# Vivado block design design_1, xczu28dr-ffvg1517-2-e, Vivado 2019.1
# (continued, part 2 of 5)
current_bd_instance /rx_datapath/macro_channel_3

create_bd_cell -type ip -vlnv user.org:user:tlast_gen_v1_0:1.0 tlast_gen_v1_0_0
create_bd_cell -type ip -vlnv xilinx.com:ip:axis_data_fifo:2.0 axis_data_fifo_3
set_property -dict [list \
  CONFIG.FIFO_DEPTH 4096 \
  CONFIG.FIFO_MEMORY_TYPE block \
  CONFIG.HAS_RD_DATA_COUNT 0 \
  CONFIG.HAS_TKEEP 1 \
  CONFIG.HAS_TLAST 1 \
  CONFIG.HAS_WR_DATA_COUNT 0 \
  CONFIG.IS_ACLK_ASYNC 1 \
  CONFIG.SYNCHRONIZATION_STAGES 2 \
  CONFIG.TDATA_NUM_BYTES 64 \
] [get_bd_cells axis_data_fifo_3]

# ---- hierarchy /tx_datapath ----
current_bd_instance /tx_datapath
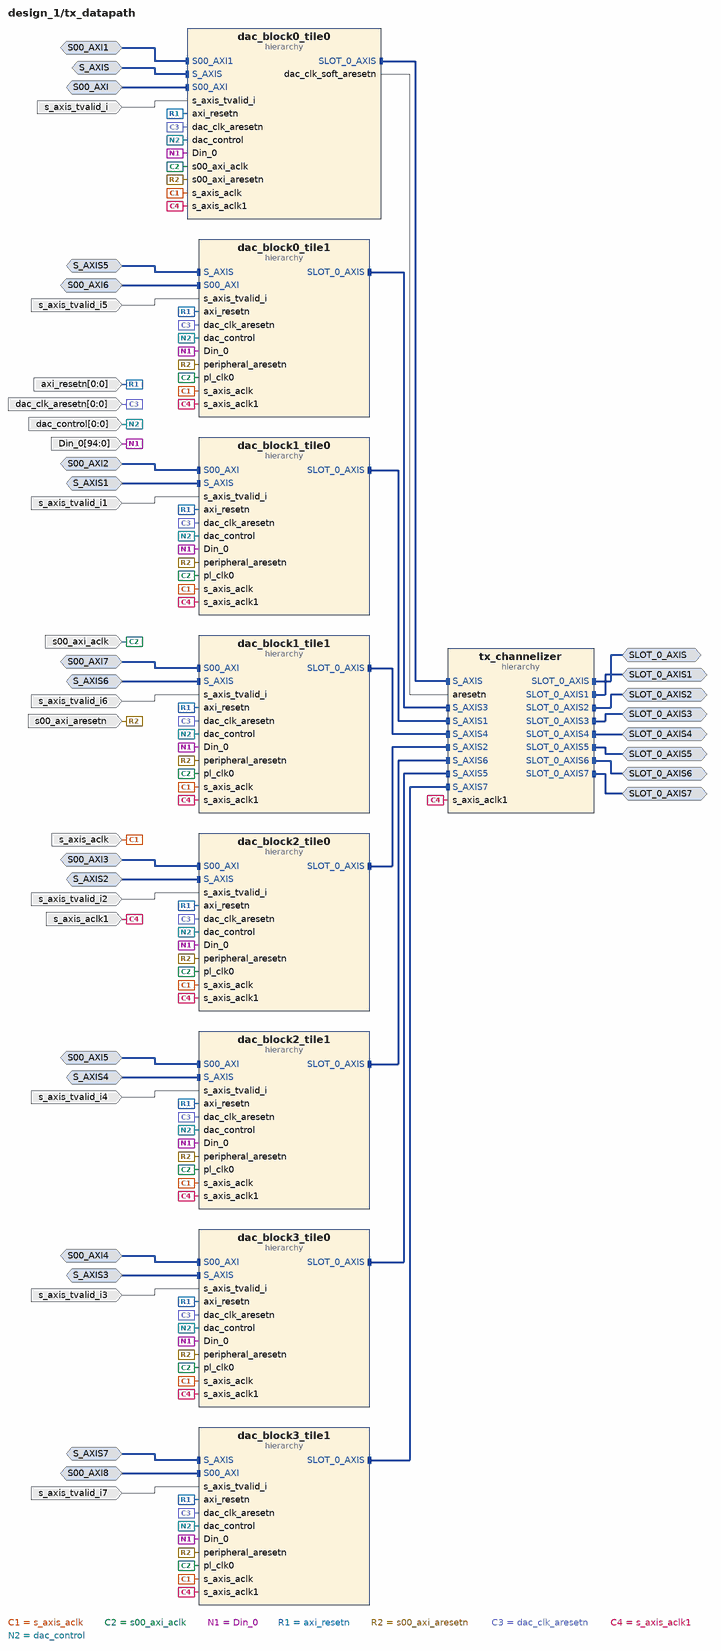
[diagram p19: block diagram inside /tx_datapath]
create_bd_intf_pin -mode Master -vlnv xilinx.com:interface:axis_rtl:1.0 SLOT_0_AXIS
create_bd_intf_pin -mode Slave -vlnv xilinx.com:interface:aximm_rtl:1.0 S00_AXI1
create_bd_intf_pin -mode Slave -vlnv xilinx.com:interface:axis_rtl:1.0 S_AXIS
create_bd_intf_pin -mode Slave -vlnv xilinx.com:interface:aximm_rtl:1.0 S00_AXI
create_bd_intf_pin -mode Slave -vlnv xilinx.com:interface:axis_rtl:1.0 S_AXIS1
create_bd_intf_pin -mode Master -vlnv xilinx.com:interface:axis_rtl:1.0 SLOT_0_AXIS1
create_bd_intf_pin -mode Slave -vlnv xilinx.com:interface:aximm_rtl:1.0 S00_AXI2
create_bd_intf_pin -mode Slave -vlnv xilinx.com:interface:axis_rtl:1.0 S_AXIS2
create_bd_intf_pin -mode Master -vlnv xilinx.com:interface:axis_rtl:1.0 SLOT_0_AXIS2
create_bd_intf_pin -mode Slave -vlnv xilinx.com:interface:aximm_rtl:1.0 S00_AXI3
create_bd_intf_pin -mode Slave -vlnv xilinx.com:interface:aximm_rtl:1.0 S00_AXI4
create_bd_intf_pin -mode Master -vlnv xilinx.com:interface:axis_rtl:1.0 SLOT_0_AXIS3
create_bd_intf_pin -mode Slave -vlnv xilinx.com:interface:axis_rtl:1.0 S_AXIS3
create_bd_intf_pin -mode Slave -vlnv xilinx.com:interface:axis_rtl:1.0 S_AXIS4
create_bd_intf_pin -mode Master -vlnv xilinx.com:interface:axis_rtl:1.0 SLOT_0_AXIS4
create_bd_intf_pin -mode Slave -vlnv xilinx.com:interface:aximm_rtl:1.0 S00_AXI5
create_bd_intf_pin -mode Master -vlnv xilinx.com:interface:axis_rtl:1.0 SLOT_0_AXIS5
create_bd_intf_pin -mode Slave -vlnv xilinx.com:interface:axis_rtl:1.0 S_AXIS5
create_bd_intf_pin -mode Slave -vlnv xilinx.com:interface:aximm_rtl:1.0 S00_AXI6
create_bd_intf_pin -mode Slave -vlnv xilinx.com:interface:axis_rtl:1.0 S_AXIS6
create_bd_intf_pin -mode Master -vlnv xilinx.com:interface:axis_rtl:1.0 SLOT_0_AXIS6
create_bd_intf_pin -mode Slave -vlnv xilinx.com:interface:aximm_rtl:1.0 S00_AXI7
create_bd_intf_pin -mode Slave -vlnv xilinx.com:interface:aximm_rtl:1.0 S00_AXI8
create_bd_intf_pin -mode Master -vlnv xilinx.com:interface:axis_rtl:1.0 SLOT_0_AXIS7
create_bd_intf_pin -mode Slave -vlnv xilinx.com:interface:axis_rtl:1.0 S_AXIS7
create_bd_pin -dir I -type clk s_axis_aclk
create_bd_pin -dir I s_axis_tvalid_i
create_bd_pin -dir I -type clk s00_axi_aclk
create_bd_pin -dir I -from 94 -to 0 Din_0
create_bd_pin -dir I -from 0 -to 0 axi_resetn
create_bd_pin -dir I -type rst s00_axi_aresetn
create_bd_pin -dir I -from 0 -to 0 dac_clk_aresetn
create_bd_pin -dir I -type clk s_axis_aclk1
create_bd_pin -dir I -from 0 -to 0 dac_control
create_bd_pin -dir I -type clk s_axis_tvalid_i1
create_bd_pin -dir I -type clk s_axis_tvalid_i2
create_bd_pin -dir I s_axis_tvalid_i3
create_bd_pin -dir I s_axis_tvalid_i4
create_bd_pin -dir I s_axis_tvalid_i5
create_bd_pin -dir I s_axis_tvalid_i6
create_bd_pin -dir I s_axis_tvalid_i7

create_bd_cell -type hier dac_block0_tile0
create_bd_cell -type hier dac_block1_tile0
create_bd_cell -type hier dac_block2_tile0
create_bd_cell -type hier dac_block3_tile0
create_bd_cell -type hier dac_block2_tile1
create_bd_cell -type hier dac_block0_tile1
create_bd_cell -type hier dac_block1_tile1
create_bd_cell -type hier dac_block3_tile1
create_bd_cell -type hier tx_channelizer

# ---- hierarchy /tx_datapath/dac_block0_tile0 ----
current_bd_instance /tx_datapath/dac_block0_tile0
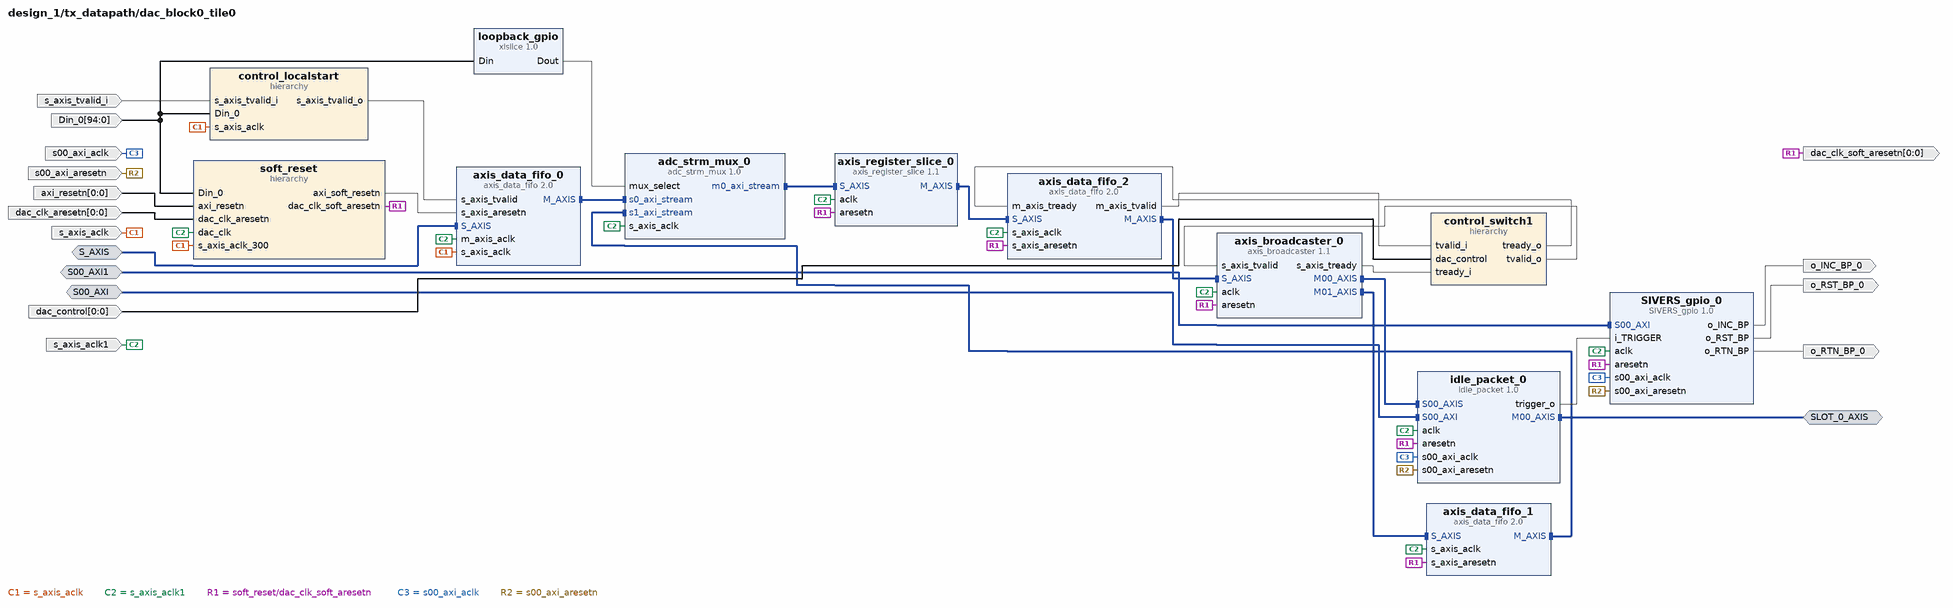
[diagram p20: block diagram inside /tx_datapath/dac_block0_tile0]
create_bd_intf_pin -mode Slave -vlnv xilinx.com:interface:axis_rtl:1.0 S_AXIS
create_bd_intf_pin -mode Master -vlnv xilinx.com:interface:axis_rtl:1.0 SLOT_0_AXIS
create_bd_intf_pin -mode Slave -vlnv xilinx.com:interface:aximm_rtl:1.0 S00_AXI
create_bd_intf_pin -mode Slave -vlnv xilinx.com:interface:aximm_rtl:1.0 S00_AXI1
create_bd_pin -dir I -type clk s_axis_aclk
create_bd_pin -dir I -type clk s_axis_aclk1
create_bd_pin -dir I -from 0 -to 0 dac_control
create_bd_pin -dir I -from 94 -to 0 Din_0
create_bd_pin -dir I -from 0 -to 0 axi_resetn
create_bd_pin -dir I -from 0 -to 0 dac_clk_aresetn
create_bd_pin -dir I s_axis_tvalid_i
create_bd_pin -dir I -type clk s00_axi_aclk
create_bd_pin -dir I -type rst s00_axi_aresetn
create_bd_pin -dir O o_INC_BP_0
create_bd_pin -dir O o_RST_BP_0
create_bd_pin -dir O o_RTN_BP_0
create_bd_pin -dir O -from 0 -to 0 -type rst dac_clk_soft_aresetn

create_bd_cell -type ip -vlnv xilinx.com:ip:axis_data_fifo:2.0 axis_data_fifo_0
set_property -dict [list \
  CONFIG.FIFO_DEPTH 16 \
  CONFIG.FIFO_MEMORY_TYPE block \
  CONFIG.HAS_RD_DATA_COUNT 1 \
  CONFIG.HAS_TKEEP 1 \
  CONFIG.HAS_TLAST 1 \
  CONFIG.HAS_WR_DATA_COUNT 1 \
  CONFIG.IS_ACLK_ASYNC 1 \
  CONFIG.SYNCHRONIZATION_STAGES 2 \
  CONFIG.TDATA_NUM_BYTES 32 \
] [get_bd_cells axis_data_fifo_0]
create_bd_cell -type ip -vlnv xilinx.com:ip:axis_data_fifo:2.0 axis_data_fifo_1
set_property -dict [list \
  CONFIG.FIFO_DEPTH 16 \
  CONFIG.FIFO_MEMORY_TYPE block \
  CONFIG.HAS_RD_DATA_COUNT 1 \
  CONFIG.HAS_TKEEP 1 \
  CONFIG.HAS_TLAST 1 \
  CONFIG.HAS_WR_DATA_COUNT 1 \
  CONFIG.TDATA_NUM_BYTES 32 \
] [get_bd_cells axis_data_fifo_1]
create_bd_cell -type ip -vlnv xilinx.com:ip:axis_data_fifo:2.0 axis_data_fifo_2
set_property -dict [list \
  CONFIG.FIFO_DEPTH 4096 \
  CONFIG.FIFO_MEMORY_TYPE block \
  CONFIG.HAS_RD_DATA_COUNT 1 \
  CONFIG.HAS_TKEEP 1 \
  CONFIG.HAS_TLAST 1 \
  CONFIG.HAS_WR_DATA_COUNT 1 \
  CONFIG.TDATA_NUM_BYTES 32 \
] [get_bd_cells axis_data_fifo_2]
create_bd_cell -type ip -vlnv user.org:user:adc_strm_mux:1.0 adc_strm_mux_0
create_bd_cell -type ip -vlnv xilinx.com:ip:axis_register_slice:1.1 axis_register_slice_0
set_property -dict {CONFIG.HAS_TKEEP 1 CONFIG.HAS_TLAST 1 CONFIG.TDATA_NUM_BYTES 32} [get_bd_cells axis_register_slice_0]
create_bd_cell -type hier soft_reset
create_bd_cell -type ip -vlnv xilinx.com:ip:axis_broadcaster:1.1 axis_broadcaster_0
set_property -dict [list \
  CONFIG.M00_TDATA_REMAP {tdata[255:0]} \
  CONFIG.M01_TDATA_REMAP {tdata[255:0]} \
  CONFIG.M_TDATA_NUM_BYTES 32 \
  CONFIG.S_TDATA_NUM_BYTES 32 \
] [get_bd_cells axis_broadcaster_0]
create_bd_cell -type ip -vlnv xilinx.com:ip:xlslice:1.0 loopback_gpio
set_property -dict {CONFIG.DIN_FROM 8 CONFIG.DIN_TO 8 CONFIG.DIN_WIDTH 95 CONFIG.DOUT_WIDTH 1} [get_bd_cells loopback_gpio]
create_bd_cell -type hier control_switch1
create_bd_cell -type hier control_localstart
create_bd_cell -type ip -vlnv user.org:user:idle_packet:1.0 idle_packet_0
create_bd_cell -type ip -vlnv user.org:user:SIVERS_gpio:1.0 SIVERS_gpio_0

# ---- hierarchy /tx_datapath/dac_block0_tile0/soft_reset ----
current_bd_instance /tx_datapath/dac_block0_tile0/soft_reset
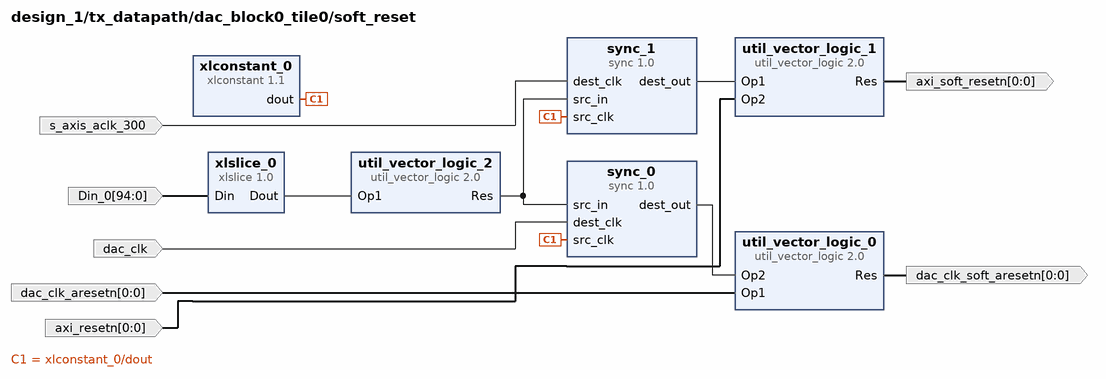
[diagram p21: block diagram inside /tx_datapath/dac_block0_tile0/soft_reset]
create_bd_pin -dir I -from 94 -to 0 Din_0
create_bd_pin -dir I -type clk dac_clk
create_bd_pin -dir I -type clk s_axis_aclk_300
create_bd_pin -dir O -from 0 -to 0 dac_clk_soft_aresetn
create_bd_pin -dir O -from 0 -to 0 axi_soft_resetn
create_bd_pin -dir I -from 0 -to 0 dac_clk_aresetn
create_bd_pin -dir I -from 0 -to 0 axi_resetn

create_bd_cell -type ip -vlnv xilinx.com:ip:xlslice:1.0 xlslice_0
set_property -dict {CONFIG.DIN_FROM 0 CONFIG.DIN_TO 0 CONFIG.DIN_WIDTH 95 CONFIG.DOUT_WIDTH 1} [get_bd_cells xlslice_0]
create_bd_cell -type ip -vlnv xilinx.com:user:sync:1.0 sync_0
set_property -dict {CONFIG.SRC_INPUT_REG 0} [get_bd_cells sync_0]
create_bd_cell -type ip -vlnv xilinx.com:user:sync:1.0 sync_1
set_property -dict {CONFIG.SRC_INPUT_REG 0} [get_bd_cells sync_1]
create_bd_cell -type ip -vlnv xilinx.com:ip:xlconstant:1.1 xlconstant_0
set_property -dict {CONFIG.CONST_VAL 0} [get_bd_cells xlconstant_0]
create_bd_cell -type ip -vlnv xilinx.com:ip:util_vector_logic:2.0 util_vector_logic_2
set_property -dict {CONFIG.C_OPERATION not CONFIG.C_SIZE 1} [get_bd_cells util_vector_logic_2]
create_bd_cell -type ip -vlnv xilinx.com:ip:util_vector_logic:2.0 util_vector_logic_0
set_property -dict {CONFIG.C_SIZE 1} [get_bd_cells util_vector_logic_0]
create_bd_cell -type ip -vlnv xilinx.com:ip:util_vector_logic:2.0 util_vector_logic_1
set_property -dict {CONFIG.C_SIZE 1} [get_bd_cells util_vector_logic_1]

# ---- hierarchy /tx_datapath/dac_block0_tile0/control_switch1 ----
current_bd_instance /tx_datapath/dac_block0_tile0/control_switch1
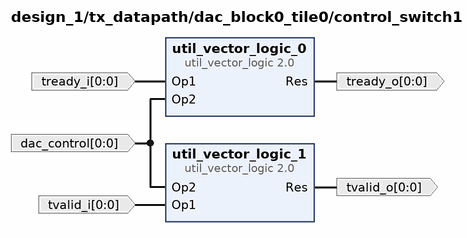
[diagram p22: block diagram inside /tx_datapath/dac_block0_tile0/control_switch1]
create_bd_pin -dir I -from 0 -to 0 tready_i
create_bd_pin -dir I -from 0 -to 0 tvalid_i
create_bd_pin -dir O -from 0 -to 0 tready_o
create_bd_pin -dir O -from 0 -to 0 tvalid_o
create_bd_pin -dir I -from 0 -to 0 dac_control

create_bd_cell -type ip -vlnv xilinx.com:ip:util_vector_logic:2.0 util_vector_logic_0
set_property -dict {CONFIG.C_SIZE 1} [get_bd_cells util_vector_logic_0]
create_bd_cell -type ip -vlnv xilinx.com:ip:util_vector_logic:2.0 util_vector_logic_1
set_property -dict {CONFIG.C_SIZE 1} [get_bd_cells util_vector_logic_1]

# ---- hierarchy /tx_datapath/dac_block0_tile0/control_localstart ----
current_bd_instance /tx_datapath/dac_block0_tile0/control_localstart
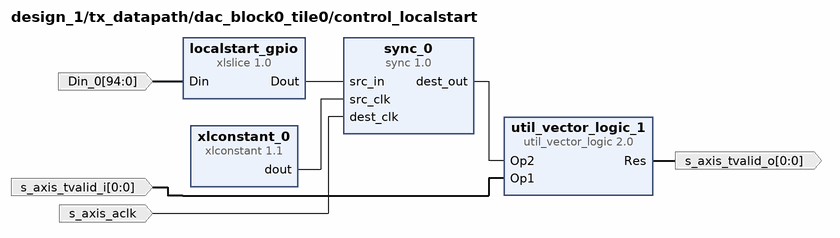
[diagram p23: block diagram inside /tx_datapath/dac_block0_tile0/control_localstart]
create_bd_pin -dir I -from 0 -to 0 s_axis_tvalid_i
create_bd_pin -dir O -from 0 -to 0 s_axis_tvalid_o
create_bd_pin -dir I -from 94 -to 0 Din_0
create_bd_pin -dir I -type clk s_axis_aclk

create_bd_cell -type ip -vlnv xilinx.com:ip:util_vector_logic:2.0 util_vector_logic_1
set_property -dict {CONFIG.C_SIZE 1} [get_bd_cells util_vector_logic_1]
create_bd_cell -type ip -vlnv xilinx.com:ip:xlslice:1.0 localstart_gpio
set_property -dict {CONFIG.DIN_FROM 16 CONFIG.DIN_TO 16 CONFIG.DIN_WIDTH 95 CONFIG.DOUT_WIDTH 1} [get_bd_cells localstart_gpio]
create_bd_cell -type ip -vlnv xilinx.com:user:sync:1.0 sync_0
set_property -dict {CONFIG.DEST_SYNC_FF 2 CONFIG.SRC_INPUT_REG 0} [get_bd_cells sync_0]
create_bd_cell -type ip -vlnv xilinx.com:ip:xlconstant:1.1 xlconstant_0
set_property -dict {CONFIG.CONST_VAL 0} [get_bd_cells xlconstant_0]

# ---- hierarchy /tx_datapath/dac_block1_tile0 ----
current_bd_instance /tx_datapath/dac_block1_tile0
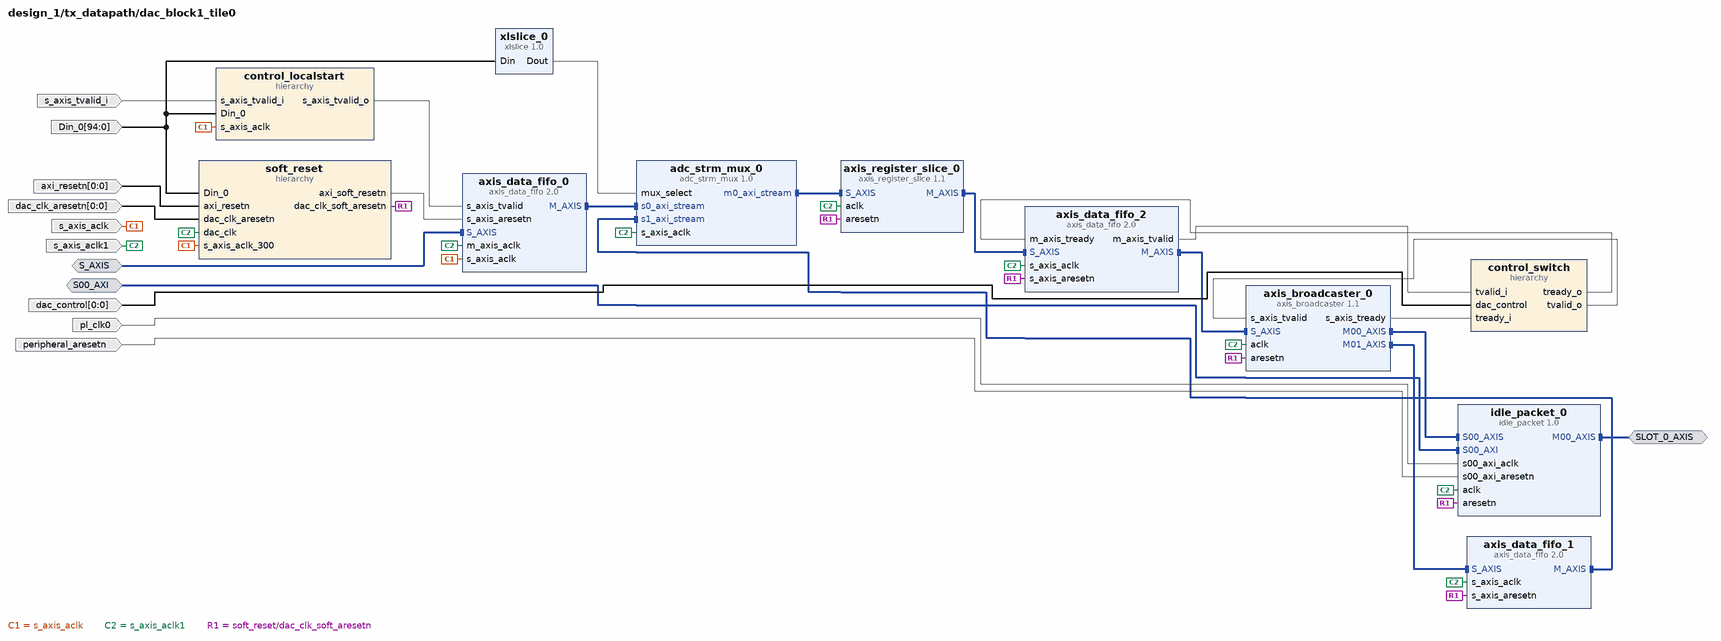
[diagram p24: block diagram inside /tx_datapath/dac_block1_tile0]
create_bd_intf_pin -mode Slave -vlnv xilinx.com:interface:axis_rtl:1.0 S_AXIS
create_bd_intf_pin -mode Master -vlnv xilinx.com:interface:axis_rtl:1.0 SLOT_0_AXIS
create_bd_intf_pin -mode Slave -vlnv xilinx.com:interface:aximm_rtl:1.0 S00_AXI
create_bd_pin -dir I -type clk s_axis_aclk
create_bd_pin -dir I -type clk s_axis_aclk1
create_bd_pin -dir I -from 0 -to 0 dac_control
create_bd_pin -dir I -from 94 -to 0 Din_0
create_bd_pin -dir I -from 0 -to 0 axi_resetn
create_bd_pin -dir I -from 0 -to 0 dac_clk_aresetn
create_bd_pin -dir I -type clk s_axis_tvalid_i
create_bd_pin -dir I -type clk pl_clk0
create_bd_pin -dir I -type rst peripheral_aresetn

create_bd_cell -type ip -vlnv xilinx.com:ip:axis_data_fifo:2.0 axis_data_fifo_0
set_property -dict [list \
  CONFIG.FIFO_DEPTH 16 \
  CONFIG.FIFO_MEMORY_TYPE block \
  CONFIG.HAS_RD_DATA_COUNT 1 \
  CONFIG.HAS_TKEEP 1 \
  CONFIG.HAS_TLAST 1 \
  CONFIG.HAS_WR_DATA_COUNT 1 \
  CONFIG.IS_ACLK_ASYNC 1 \
  CONFIG.SYNCHRONIZATION_STAGES 2 \
  CONFIG.TDATA_NUM_BYTES 32 \
] [get_bd_cells axis_data_fifo_0]
create_bd_cell -type ip -vlnv xilinx.com:ip:axis_data_fifo:2.0 axis_data_fifo_1
set_property -dict [list \
  CONFIG.FIFO_DEPTH 16 \
  CONFIG.FIFO_MEMORY_TYPE block \
  CONFIG.HAS_RD_DATA_COUNT 1 \
  CONFIG.HAS_TKEEP 1 \
  CONFIG.HAS_TLAST 1 \
  CONFIG.HAS_WR_DATA_COUNT 1 \
  CONFIG.TDATA_NUM_BYTES 32 \
] [get_bd_cells axis_data_fifo_1]
create_bd_cell -type ip -vlnv xilinx.com:ip:axis_data_fifo:2.0 axis_data_fifo_2
set_property -dict [list \
  CONFIG.FIFO_DEPTH 4096 \
  CONFIG.FIFO_MEMORY_TYPE block \
  CONFIG.HAS_RD_DATA_COUNT 1 \
  CONFIG.HAS_TKEEP 1 \
  CONFIG.HAS_TLAST 1 \
  CONFIG.HAS_WR_DATA_COUNT 1 \
  CONFIG.TDATA_NUM_BYTES 32 \
] [get_bd_cells axis_data_fifo_2]
create_bd_cell -type ip -vlnv user.org:user:adc_strm_mux:1.0 adc_strm_mux_0
create_bd_cell -type hier control_switch
create_bd_cell -type ip -vlnv xilinx.com:ip:axis_register_slice:1.1 axis_register_slice_0
set_property -dict {CONFIG.HAS_TKEEP 1 CONFIG.HAS_TLAST 1 CONFIG.TDATA_NUM_BYTES 32} [get_bd_cells axis_register_slice_0]
create_bd_cell -type hier soft_reset
create_bd_cell -type ip -vlnv xilinx.com:ip:axis_broadcaster:1.1 axis_broadcaster_0
set_property -dict [list \
  CONFIG.M00_TDATA_REMAP {tdata[255:0]} \
  CONFIG.M01_TDATA_REMAP {tdata[255:0]} \
  CONFIG.M_TDATA_NUM_BYTES 32 \
  CONFIG.S_TDATA_NUM_BYTES 32 \
] [get_bd_cells axis_broadcaster_0]
create_bd_cell -type ip -vlnv xilinx.com:ip:xlslice:1.0 xlslice_0
set_property -dict {CONFIG.DIN_FROM 9 CONFIG.DIN_TO 9 CONFIG.DIN_WIDTH 95 CONFIG.DOUT_WIDTH 1} [get_bd_cells xlslice_0]
create_bd_cell -type hier control_localstart
create_bd_cell -type ip -vlnv user.org:user:idle_packet:1.0 idle_packet_0

# ---- hierarchy /tx_datapath/dac_block1_tile0/control_switch ----
current_bd_instance /tx_datapath/dac_block1_tile0/control_switch
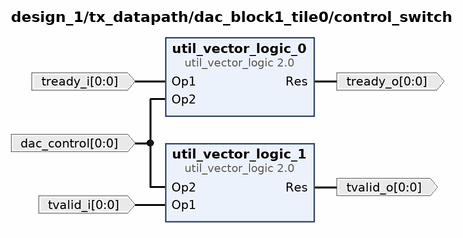
[diagram p25: block diagram inside /tx_datapath/dac_block1_tile0/control_switch]
create_bd_pin -dir I -from 0 -to 0 tready_i
create_bd_pin -dir I -from 0 -to 0 tvalid_i
create_bd_pin -dir O -from 0 -to 0 tready_o
create_bd_pin -dir O -from 0 -to 0 tvalid_o
create_bd_pin -dir I -from 0 -to 0 dac_control

create_bd_cell -type ip -vlnv xilinx.com:ip:util_vector_logic:2.0 util_vector_logic_0
set_property -dict {CONFIG.C_SIZE 1} [get_bd_cells util_vector_logic_0]
create_bd_cell -type ip -vlnv xilinx.com:ip:util_vector_logic:2.0 util_vector_logic_1
set_property -dict {CONFIG.C_SIZE 1} [get_bd_cells util_vector_logic_1]

# ---- hierarchy /tx_datapath/dac_block1_tile0/soft_reset ----
current_bd_instance /tx_datapath/dac_block1_tile0/soft_reset
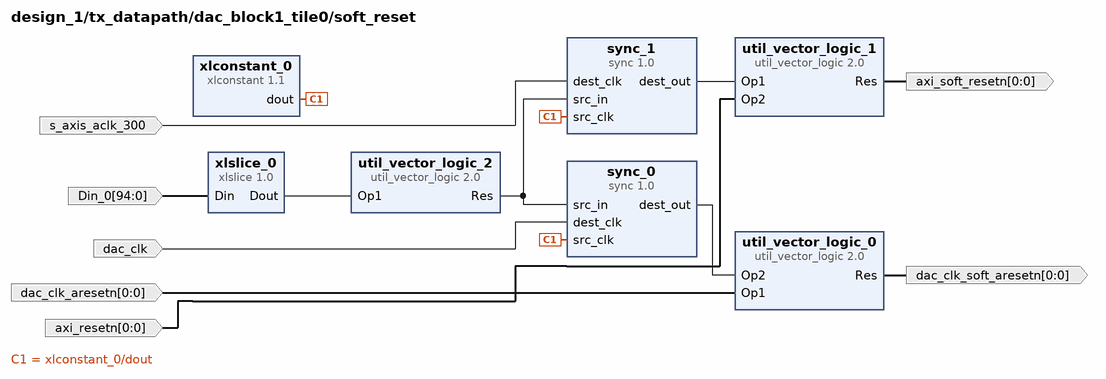
[diagram p26: block diagram inside /tx_datapath/dac_block1_tile0/soft_reset]
create_bd_pin -dir I -from 94 -to 0 Din_0
create_bd_pin -dir I -type clk dac_clk
create_bd_pin -dir I -type clk s_axis_aclk_300
create_bd_pin -dir O -from 0 -to 0 dac_clk_soft_aresetn
create_bd_pin -dir O -from 0 -to 0 axi_soft_resetn
create_bd_pin -dir I -from 0 -to 0 dac_clk_aresetn
create_bd_pin -dir I -from 0 -to 0 axi_resetn

create_bd_cell -type ip -vlnv xilinx.com:ip:xlslice:1.0 xlslice_0
set_property -dict {CONFIG.DIN_FROM 1 CONFIG.DIN_TO 1 CONFIG.DIN_WIDTH 95 CONFIG.DOUT_WIDTH 1} [get_bd_cells xlslice_0]
create_bd_cell -type ip -vlnv xilinx.com:user:sync:1.0 sync_0
set_property -dict {CONFIG.SRC_INPUT_REG 0} [get_bd_cells sync_0]
create_bd_cell -type ip -vlnv xilinx.com:user:sync:1.0 sync_1
set_property -dict {CONFIG.SRC_INPUT_REG 0} [get_bd_cells sync_1]
create_bd_cell -type ip -vlnv xilinx.com:ip:xlconstant:1.1 xlconstant_0
set_property -dict {CONFIG.CONST_VAL 0} [get_bd_cells xlconstant_0]
create_bd_cell -type ip -vlnv xilinx.com:ip:util_vector_logic:2.0 util_vector_logic_2
set_property -dict {CONFIG.C_OPERATION not CONFIG.C_SIZE 1} [get_bd_cells util_vector_logic_2]
create_bd_cell -type ip -vlnv xilinx.com:ip:util_vector_logic:2.0 util_vector_logic_0
set_property -dict {CONFIG.C_SIZE 1} [get_bd_cells util_vector_logic_0]
create_bd_cell -type ip -vlnv xilinx.com:ip:util_vector_logic:2.0 util_vector_logic_1
set_property -dict {CONFIG.C_SIZE 1} [get_bd_cells util_vector_logic_1]

# ---- hierarchy /tx_datapath/dac_block1_tile0/control_localstart ----
current_bd_instance /tx_datapath/dac_block1_tile0/control_localstart
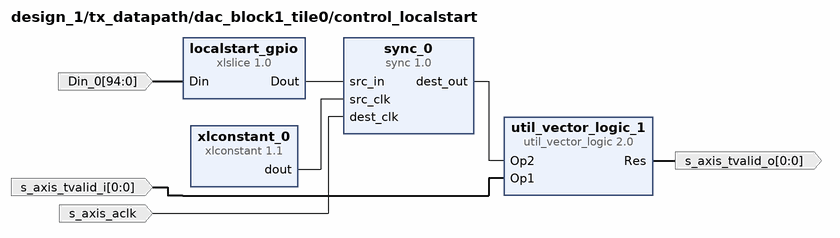
[diagram p27: block diagram inside /tx_datapath/dac_block1_tile0/control_localstart]
create_bd_pin -dir I -from 0 -to 0 s_axis_tvalid_i
create_bd_pin -dir O -from 0 -to 0 s_axis_tvalid_o
create_bd_pin -dir I -from 94 -to 0 Din_0
create_bd_pin -dir I -type clk s_axis_aclk

create_bd_cell -type ip -vlnv xilinx.com:ip:util_vector_logic:2.0 util_vector_logic_1
set_property -dict {CONFIG.C_SIZE 1} [get_bd_cells util_vector_logic_1]
create_bd_cell -type ip -vlnv xilinx.com:ip:xlslice:1.0 localstart_gpio
set_property -dict {CONFIG.DIN_FROM 17 CONFIG.DIN_TO 17 CONFIG.DIN_WIDTH 95 CONFIG.DOUT_WIDTH 1} [get_bd_cells localstart_gpio]
create_bd_cell -type ip -vlnv xilinx.com:user:sync:1.0 sync_0
set_property -dict {CONFIG.DEST_SYNC_FF 2 CONFIG.SRC_INPUT_REG 0} [get_bd_cells sync_0]
create_bd_cell -type ip -vlnv xilinx.com:ip:xlconstant:1.1 xlconstant_0
set_property -dict {CONFIG.CONST_VAL 0} [get_bd_cells xlconstant_0]

# ---- hierarchy /tx_datapath/dac_block2_tile0 ----
current_bd_instance /tx_datapath/dac_block2_tile0
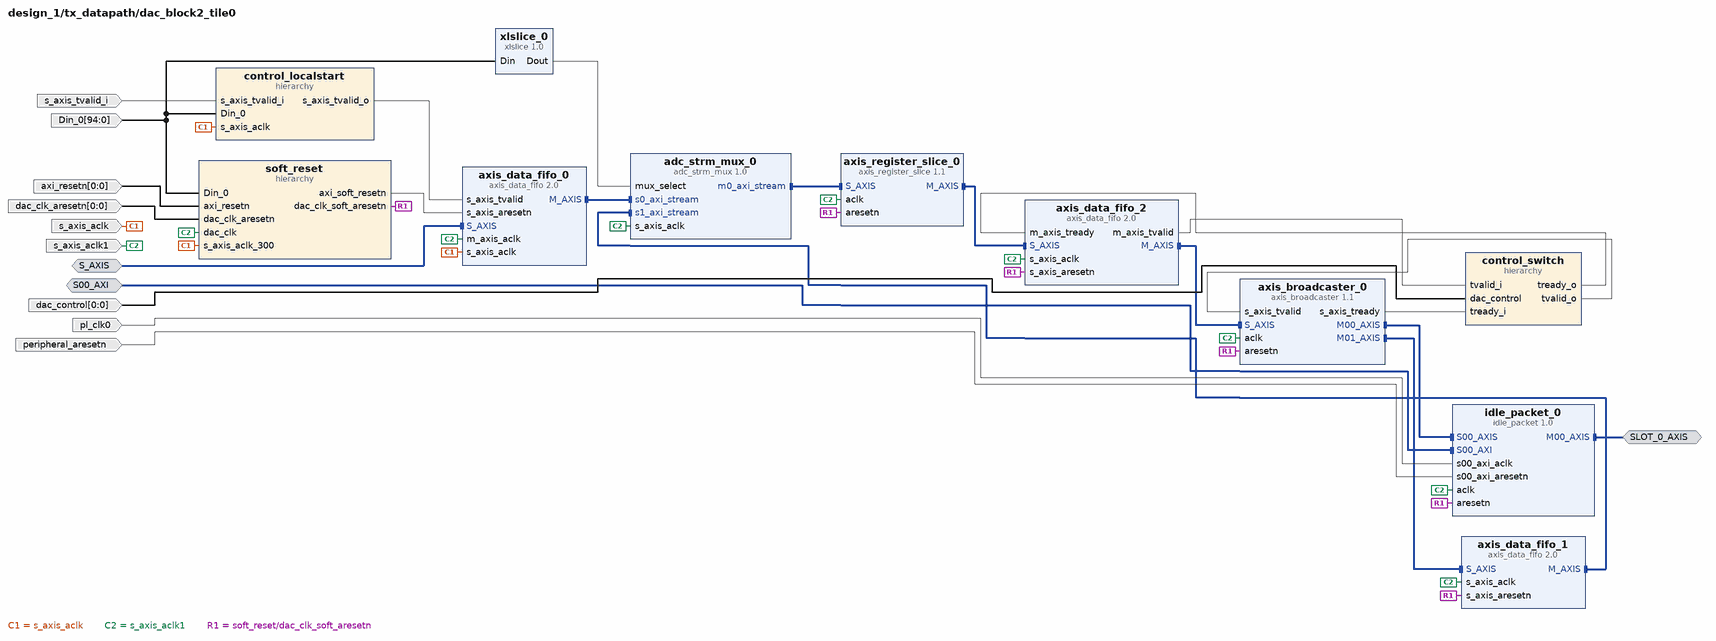
[diagram p28: block diagram inside /tx_datapath/dac_block2_tile0]
create_bd_intf_pin -mode Slave -vlnv xilinx.com:interface:axis_rtl:1.0 S_AXIS
create_bd_intf_pin -mode Master -vlnv xilinx.com:interface:axis_rtl:1.0 SLOT_0_AXIS
create_bd_intf_pin -mode Slave -vlnv xilinx.com:interface:aximm_rtl:1.0 S00_AXI
create_bd_pin -dir I -type clk s_axis_aclk
create_bd_pin -dir I -type clk s_axis_aclk1
create_bd_pin -dir I -from 0 -to 0 dac_control
create_bd_pin -dir I -from 94 -to 0 Din_0
create_bd_pin -dir I -from 0 -to 0 axi_resetn
create_bd_pin -dir I -from 0 -to 0 dac_clk_aresetn
create_bd_pin -dir I -type clk s_axis_tvalid_i
create_bd_pin -dir I -type clk pl_clk0
create_bd_pin -dir I -type rst peripheral_aresetn

create_bd_cell -type ip -vlnv xilinx.com:ip:axis_data_fifo:2.0 axis_data_fifo_0
set_property -dict [list \
  CONFIG.FIFO_DEPTH 16 \
  CONFIG.FIFO_MEMORY_TYPE block \
  CONFIG.HAS_RD_DATA_COUNT 1 \
  CONFIG.HAS_TKEEP 1 \
  CONFIG.HAS_TLAST 1 \
  CONFIG.HAS_WR_DATA_COUNT 1 \
  CONFIG.IS_ACLK_ASYNC 1 \
  CONFIG.SYNCHRONIZATION_STAGES 2 \
  CONFIG.TDATA_NUM_BYTES 32 \
] [get_bd_cells axis_data_fifo_0]
create_bd_cell -type ip -vlnv xilinx.com:ip:axis_data_fifo:2.0 axis_data_fifo_1
set_property -dict [list \
  CONFIG.FIFO_DEPTH 16 \
  CONFIG.FIFO_MEMORY_TYPE block \
  CONFIG.HAS_RD_DATA_COUNT 1 \
  CONFIG.HAS_TKEEP 1 \
  CONFIG.HAS_TLAST 1 \
  CONFIG.HAS_WR_DATA_COUNT 1 \
  CONFIG.TDATA_NUM_BYTES 32 \
] [get_bd_cells axis_data_fifo_1]
create_bd_cell -type ip -vlnv xilinx.com:ip:axis_data_fifo:2.0 axis_data_fifo_2
set_property -dict [list \
  CONFIG.FIFO_DEPTH 4096 \
  CONFIG.FIFO_MEMORY_TYPE block \
  CONFIG.HAS_RD_DATA_COUNT 1 \
  CONFIG.HAS_TKEEP 1 \
  CONFIG.HAS_TLAST 1 \
  CONFIG.HAS_WR_DATA_COUNT 1 \
  CONFIG.TDATA_NUM_BYTES 32 \
] [get_bd_cells axis_data_fifo_2]
create_bd_cell -type ip -vlnv user.org:user:adc_strm_mux:1.0 adc_strm_mux_0
create_bd_cell -type hier control_switch
create_bd_cell -type ip -vlnv xilinx.com:ip:axis_register_slice:1.1 axis_register_slice_0
set_property -dict {CONFIG.HAS_TKEEP 1 CONFIG.HAS_TLAST 1 CONFIG.TDATA_NUM_BYTES 32} [get_bd_cells axis_register_slice_0]
create_bd_cell -type hier soft_reset
create_bd_cell -type ip -vlnv xilinx.com:ip:axis_broadcaster:1.1 axis_broadcaster_0
set_property -dict [list \
  CONFIG.M00_TDATA_REMAP {tdata[255:0]} \
  CONFIG.M01_TDATA_REMAP {tdata[255:0]} \
  CONFIG.M_TDATA_NUM_BYTES 32 \
  CONFIG.S_TDATA_NUM_BYTES 32 \
] [get_bd_cells axis_broadcaster_0]
create_bd_cell -type ip -vlnv xilinx.com:ip:xlslice:1.0 xlslice_0
set_property -dict {CONFIG.DIN_FROM 10 CONFIG.DIN_TO 10 CONFIG.DIN_WIDTH 95 CONFIG.DOUT_WIDTH 1} [get_bd_cells xlslice_0]
create_bd_cell -type hier control_localstart
create_bd_cell -type ip -vlnv user.org:user:idle_packet:1.0 idle_packet_0

# ---- hierarchy /tx_datapath/dac_block2_tile0/control_switch ----
current_bd_instance /tx_datapath/dac_block2_tile0/control_switch
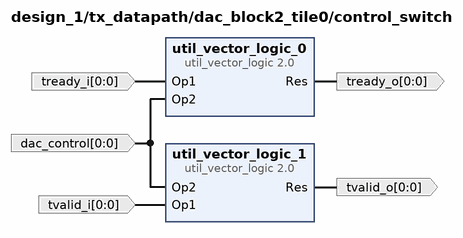
[diagram p29: block diagram inside /tx_datapath/dac_block2_tile0/control_switch]
create_bd_pin -dir I -from 0 -to 0 tready_i
create_bd_pin -dir I -from 0 -to 0 tvalid_i
create_bd_pin -dir O -from 0 -to 0 tready_o
create_bd_pin -dir O -from 0 -to 0 tvalid_o
create_bd_pin -dir I -from 0 -to 0 dac_control

create_bd_cell -type ip -vlnv xilinx.com:ip:util_vector_logic:2.0 util_vector_logic_0
set_property -dict {CONFIG.C_SIZE 1} [get_bd_cells util_vector_logic_0]
create_bd_cell -type ip -vlnv xilinx.com:ip:util_vector_logic:2.0 util_vector_logic_1
set_property -dict {CONFIG.C_SIZE 1} [get_bd_cells util_vector_logic_1]

# ---- hierarchy /tx_datapath/dac_block2_tile0/soft_reset ----
current_bd_instance /tx_datapath/dac_block2_tile0/soft_reset
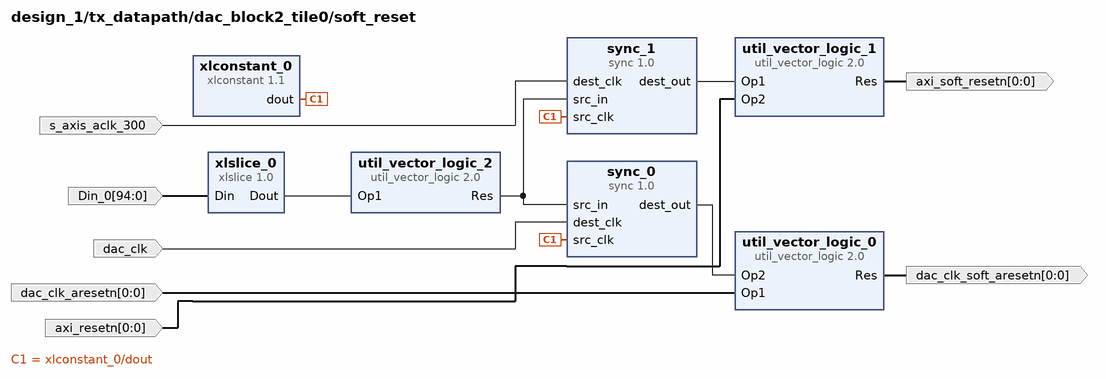
[diagram p30: block diagram inside /tx_datapath/dac_block2_tile0/soft_reset]
create_bd_pin -dir I -from 94 -to 0 Din_0
create_bd_pin -dir I -type clk dac_clk
create_bd_pin -dir I -type clk s_axis_aclk_300
create_bd_pin -dir O -from 0 -to 0 dac_clk_soft_aresetn
create_bd_pin -dir O -from 0 -to 0 axi_soft_resetn
create_bd_pin -dir I -from 0 -to 0 dac_clk_aresetn
create_bd_pin -dir I -from 0 -to 0 axi_resetn

create_bd_cell -type ip -vlnv xilinx.com:ip:xlslice:1.0 xlslice_0
set_property -dict {CONFIG.DIN_FROM 2 CONFIG.DIN_TO 2 CONFIG.DIN_WIDTH 95 CONFIG.DOUT_WIDTH 1} [get_bd_cells xlslice_0]
create_bd_cell -type ip -vlnv xilinx.com:user:sync:1.0 sync_0
set_property -dict {CONFIG.SRC_INPUT_REG 0} [get_bd_cells sync_0]
create_bd_cell -type ip -vlnv xilinx.com:user:sync:1.0 sync_1
set_property -dict {CONFIG.SRC_INPUT_REG 0} [get_bd_cells sync_1]
create_bd_cell -type ip -vlnv xilinx.com:ip:xlconstant:1.1 xlconstant_0
set_property -dict {CONFIG.CONST_VAL 0} [get_bd_cells xlconstant_0]
create_bd_cell -type ip -vlnv xilinx.com:ip:util_vector_logic:2.0 util_vector_logic_2
set_property -dict {CONFIG.C_OPERATION not CONFIG.C_SIZE 1} [get_bd_cells util_vector_logic_2]
create_bd_cell -type ip -vlnv xilinx.com:ip:util_vector_logic:2.0 util_vector_logic_0
set_property -dict {CONFIG.C_SIZE 1} [get_bd_cells util_vector_logic_0]
create_bd_cell -type ip -vlnv xilinx.com:ip:util_vector_logic:2.0 util_vector_logic_1
set_property -dict {CONFIG.C_SIZE 1} [get_bd_cells util_vector_logic_1]

# ---- hierarchy /tx_datapath/dac_block2_tile0/control_localstart ----
current_bd_instance /tx_datapath/dac_block2_tile0/control_localstart
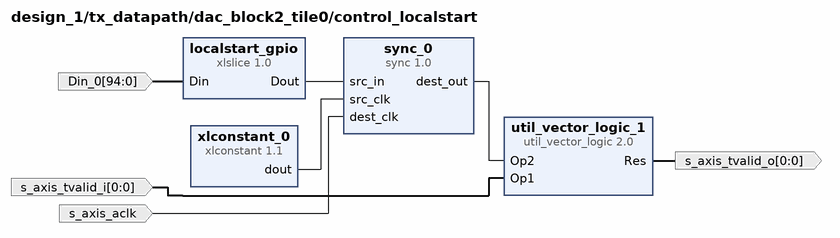
[diagram p31: block diagram inside /tx_datapath/dac_block2_tile0/control_localstart]
create_bd_pin -dir I -from 0 -to 0 s_axis_tvalid_i
create_bd_pin -dir O -from 0 -to 0 s_axis_tvalid_o
create_bd_pin -dir I -from 94 -to 0 Din_0
create_bd_pin -dir I -type clk s_axis_aclk

create_bd_cell -type ip -vlnv xilinx.com:ip:util_vector_logic:2.0 util_vector_logic_1
set_property -dict {CONFIG.C_SIZE 1} [get_bd_cells util_vector_logic_1]
create_bd_cell -type ip -vlnv xilinx.com:ip:xlslice:1.0 localstart_gpio
set_property -dict {CONFIG.DIN_FROM 18 CONFIG.DIN_TO 18 CONFIG.DIN_WIDTH 95 CONFIG.DOUT_WIDTH 1} [get_bd_cells localstart_gpio]
create_bd_cell -type ip -vlnv xilinx.com:user:sync:1.0 sync_0
set_property -dict {CONFIG.DEST_SYNC_FF 2 CONFIG.SRC_INPUT_REG 0} [get_bd_cells sync_0]
create_bd_cell -type ip -vlnv xilinx.com:ip:xlconstant:1.1 xlconstant_0
set_property -dict {CONFIG.CONST_VAL 0} [get_bd_cells xlconstant_0]

# ---- hierarchy /tx_datapath/dac_block3_tile0 ----
current_bd_instance /tx_datapath/dac_block3_tile0
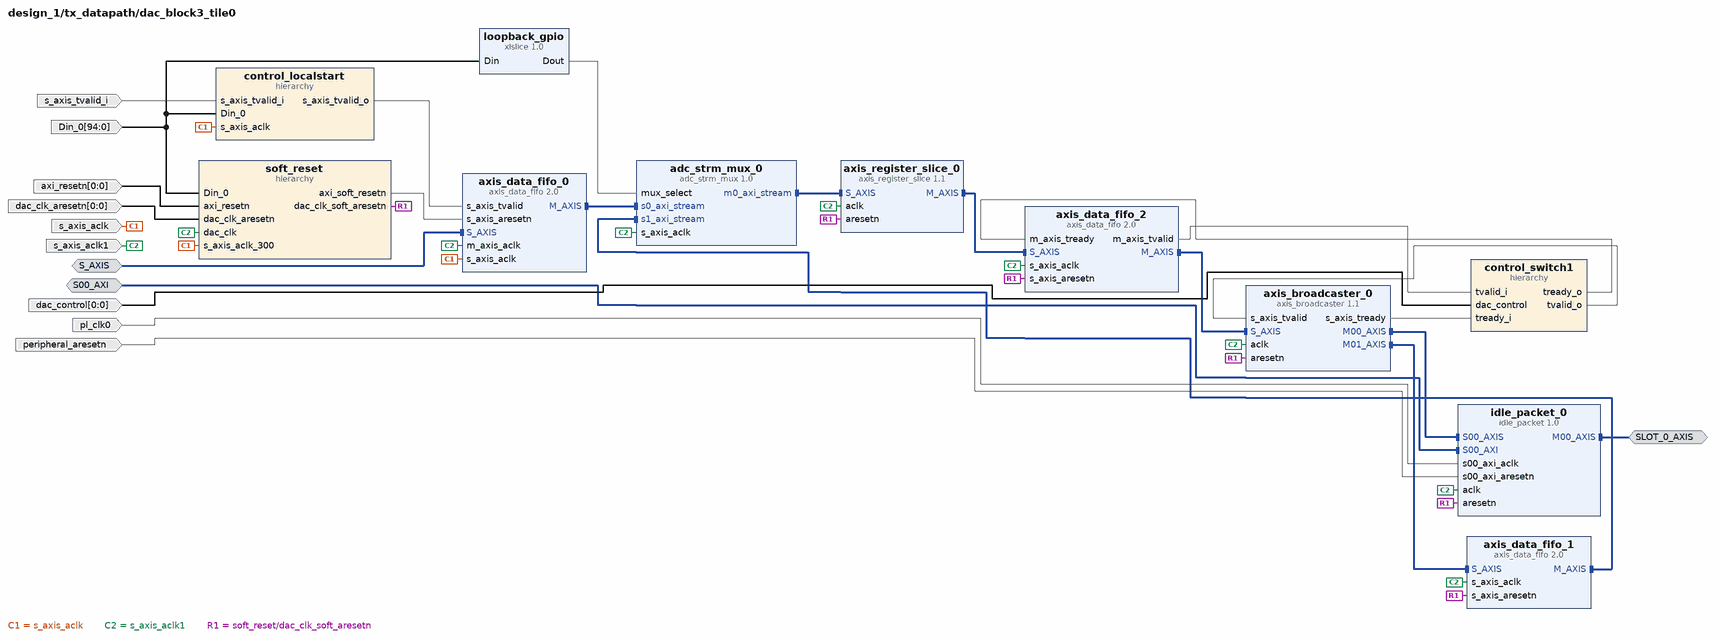
[diagram p32: block diagram inside /tx_datapath/dac_block3_tile0]
create_bd_intf_pin -mode Slave -vlnv xilinx.com:interface:axis_rtl:1.0 S_AXIS
create_bd_intf_pin -mode Master -vlnv xilinx.com:interface:axis_rtl:1.0 SLOT_0_AXIS
create_bd_intf_pin -mode Slave -vlnv xilinx.com:interface:aximm_rtl:1.0 S00_AXI
create_bd_pin -dir I -type clk s_axis_aclk
create_bd_pin -dir I -type clk s_axis_aclk1
create_bd_pin -dir I -from 0 -to 0 dac_control
create_bd_pin -dir I -from 94 -to 0 Din_0
create_bd_pin -dir I -from 0 -to 0 axi_resetn
create_bd_pin -dir I -from 0 -to 0 dac_clk_aresetn
create_bd_pin -dir I s_axis_tvalid_i
create_bd_pin -dir I -type clk pl_clk0
create_bd_pin -dir I -type rst peripheral_aresetn

create_bd_cell -type ip -vlnv xilinx.com:ip:axis_data_fifo:2.0 axis_data_fifo_0
set_property -dict [list \
  CONFIG.FIFO_DEPTH 16 \
  CONFIG.FIFO_MEMORY_TYPE block \
  CONFIG.HAS_RD_DATA_COUNT 1 \
  CONFIG.HAS_TKEEP 1 \
  CONFIG.HAS_TLAST 1 \
  CONFIG.HAS_WR_DATA_COUNT 1 \
  CONFIG.IS_ACLK_ASYNC 1 \
  CONFIG.SYNCHRONIZATION_STAGES 2 \
  CONFIG.TDATA_NUM_BYTES 32 \
] [get_bd_cells axis_data_fifo_0]
create_bd_cell -type ip -vlnv xilinx.com:ip:axis_data_fifo:2.0 axis_data_fifo_1
set_property -dict [list \
  CONFIG.FIFO_DEPTH 16 \
  CONFIG.FIFO_MEMORY_TYPE block \
  CONFIG.HAS_RD_DATA_COUNT 1 \
  CONFIG.HAS_TKEEP 1 \
  CONFIG.HAS_TLAST 1 \
  CONFIG.HAS_WR_DATA_COUNT 1 \
  CONFIG.TDATA_NUM_BYTES 32 \
] [get_bd_cells axis_data_fifo_1]
create_bd_cell -type ip -vlnv xilinx.com:ip:axis_data_fifo:2.0 axis_data_fifo_2
set_property -dict [list \
  CONFIG.FIFO_DEPTH 4096 \
  CONFIG.FIFO_MEMORY_TYPE block \
  CONFIG.HAS_RD_DATA_COUNT 1 \
  CONFIG.HAS_TKEEP 1 \
  CONFIG.HAS_TLAST 1 \
  CONFIG.HAS_WR_DATA_COUNT 1 \
  CONFIG.TDATA_NUM_BYTES 32 \
] [get_bd_cells axis_data_fifo_2]
create_bd_cell -type ip -vlnv user.org:user:adc_strm_mux:1.0 adc_strm_mux_0
create_bd_cell -type ip -vlnv xilinx.com:ip:axis_register_slice:1.1 axis_register_slice_0
set_property -dict {CONFIG.HAS_TKEEP 1 CONFIG.HAS_TLAST 1 CONFIG.TDATA_NUM_BYTES 32} [get_bd_cells axis_register_slice_0]
create_bd_cell -type hier soft_reset
create_bd_cell -type ip -vlnv xilinx.com:ip:axis_broadcaster:1.1 axis_broadcaster_0
set_property -dict [list \
  CONFIG.M00_TDATA_REMAP {tdata[255:0]} \
  CONFIG.M01_TDATA_REMAP {tdata[255:0]} \
  CONFIG.M_TDATA_NUM_BYTES 32 \
  CONFIG.S_TDATA_NUM_BYTES 32 \
] [get_bd_cells axis_broadcaster_0]
create_bd_cell -type ip -vlnv xilinx.com:ip:xlslice:1.0 loopback_gpio
set_property -dict {CONFIG.DIN_FROM 11 CONFIG.DIN_TO 11 CONFIG.DIN_WIDTH 95 CONFIG.DOUT_WIDTH 1} [get_bd_cells loopback_gpio]
create_bd_cell -type hier control_switch1
create_bd_cell -type hier control_localstart
create_bd_cell -type ip -vlnv user.org:user:idle_packet:1.0 idle_packet_0

# ---- hierarchy /tx_datapath/dac_block3_tile0/soft_reset ----
current_bd_instance /tx_datapath/dac_block3_tile0/soft_reset
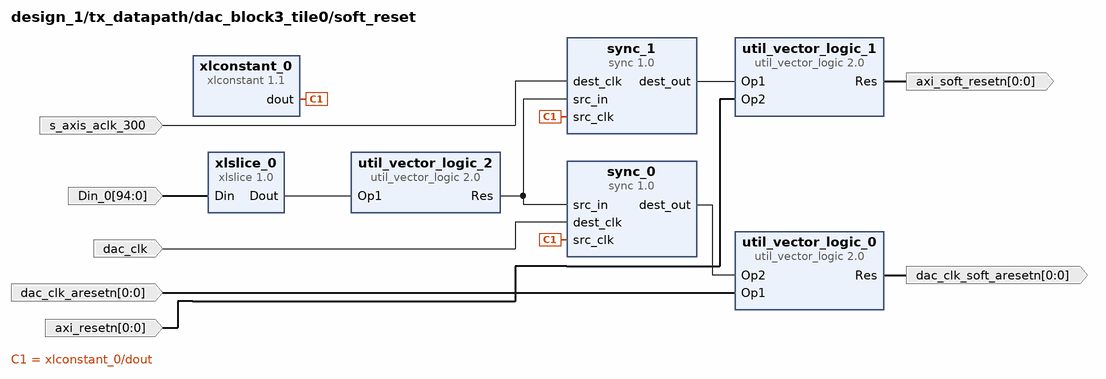
[diagram p33: block diagram inside /tx_datapath/dac_block3_tile0/soft_reset]
create_bd_pin -dir I -from 94 -to 0 Din_0
create_bd_pin -dir I -type clk dac_clk
create_bd_pin -dir I -type clk s_axis_aclk_300
create_bd_pin -dir O -from 0 -to 0 dac_clk_soft_aresetn
create_bd_pin -dir O -from 0 -to 0 axi_soft_resetn
create_bd_pin -dir I -from 0 -to 0 dac_clk_aresetn
create_bd_pin -dir I -from 0 -to 0 axi_resetn

create_bd_cell -type ip -vlnv xilinx.com:ip:xlslice:1.0 xlslice_0
set_property -dict {CONFIG.DIN_FROM 3 CONFIG.DIN_TO 3 CONFIG.DIN_WIDTH 95 CONFIG.DOUT_WIDTH 1} [get_bd_cells xlslice_0]
create_bd_cell -type ip -vlnv xilinx.com:user:sync:1.0 sync_0
set_property -dict {CONFIG.SRC_INPUT_REG 0} [get_bd_cells sync_0]
create_bd_cell -type ip -vlnv xilinx.com:user:sync:1.0 sync_1
set_property -dict {CONFIG.SRC_INPUT_REG 0} [get_bd_cells sync_1]
create_bd_cell -type ip -vlnv xilinx.com:ip:xlconstant:1.1 xlconstant_0
set_property -dict {CONFIG.CONST_VAL 0} [get_bd_cells xlconstant_0]
create_bd_cell -type ip -vlnv xilinx.com:ip:util_vector_logic:2.0 util_vector_logic_2
set_property -dict {CONFIG.C_OPERATION not CONFIG.C_SIZE 1} [get_bd_cells util_vector_logic_2]
create_bd_cell -type ip -vlnv xilinx.com:ip:util_vector_logic:2.0 util_vector_logic_0
set_property -dict {CONFIG.C_SIZE 1} [get_bd_cells util_vector_logic_0]
create_bd_cell -type ip -vlnv xilinx.com:ip:util_vector_logic:2.0 util_vector_logic_1
set_property -dict {CONFIG.C_SIZE 1} [get_bd_cells util_vector_logic_1]

# ---- hierarchy /tx_datapath/dac_block3_tile0/control_switch1 ----
current_bd_instance /tx_datapath/dac_block3_tile0/control_switch1
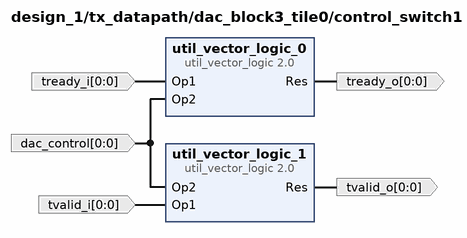
[diagram p34: block diagram inside /tx_datapath/dac_block3_tile0/control_switch1]
create_bd_pin -dir I -from 0 -to 0 tready_i
create_bd_pin -dir I -from 0 -to 0 tvalid_i
create_bd_pin -dir O -from 0 -to 0 tready_o
create_bd_pin -dir O -from 0 -to 0 tvalid_o
create_bd_pin -dir I -from 0 -to 0 dac_control

create_bd_cell -type ip -vlnv xilinx.com:ip:util_vector_logic:2.0 util_vector_logic_0
set_property -dict {CONFIG.C_SIZE 1} [get_bd_cells util_vector_logic_0]
create_bd_cell -type ip -vlnv xilinx.com:ip:util_vector_logic:2.0 util_vector_logic_1
set_property -dict {CONFIG.C_SIZE 1} [get_bd_cells util_vector_logic_1]

# ---- hierarchy /tx_datapath/dac_block3_tile0/control_localstart ----
current_bd_instance /tx_datapath/dac_block3_tile0/control_localstart
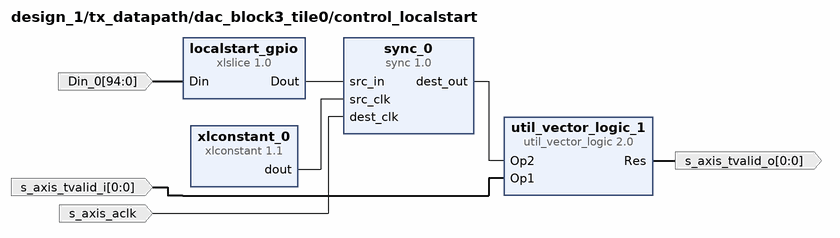
[diagram p35: block diagram inside /tx_datapath/dac_block3_tile0/control_localstart]
create_bd_pin -dir I -from 0 -to 0 s_axis_tvalid_i
create_bd_pin -dir O -from 0 -to 0 s_axis_tvalid_o
create_bd_pin -dir I -from 94 -to 0 Din_0
create_bd_pin -dir I -type clk s_axis_aclk

create_bd_cell -type ip -vlnv xilinx.com:ip:util_vector_logic:2.0 util_vector_logic_1
set_property -dict {CONFIG.C_SIZE 1} [get_bd_cells util_vector_logic_1]
create_bd_cell -type ip -vlnv xilinx.com:ip:xlslice:1.0 localstart_gpio
set_property -dict {CONFIG.DIN_FROM 19 CONFIG.DIN_TO 19 CONFIG.DIN_WIDTH 95 CONFIG.DOUT_WIDTH 1} [get_bd_cells localstart_gpio]
create_bd_cell -type ip -vlnv xilinx.com:user:sync:1.0 sync_0
set_property -dict {CONFIG.DEST_SYNC_FF 2 CONFIG.SRC_INPUT_REG 0} [get_bd_cells sync_0]
create_bd_cell -type ip -vlnv xilinx.com:ip:xlconstant:1.1 xlconstant_0
set_property -dict {CONFIG.CONST_VAL 0} [get_bd_cells xlconstant_0]

# ---- hierarchy /tx_datapath/dac_block2_tile1 ----
current_bd_instance /tx_datapath/dac_block2_tile1
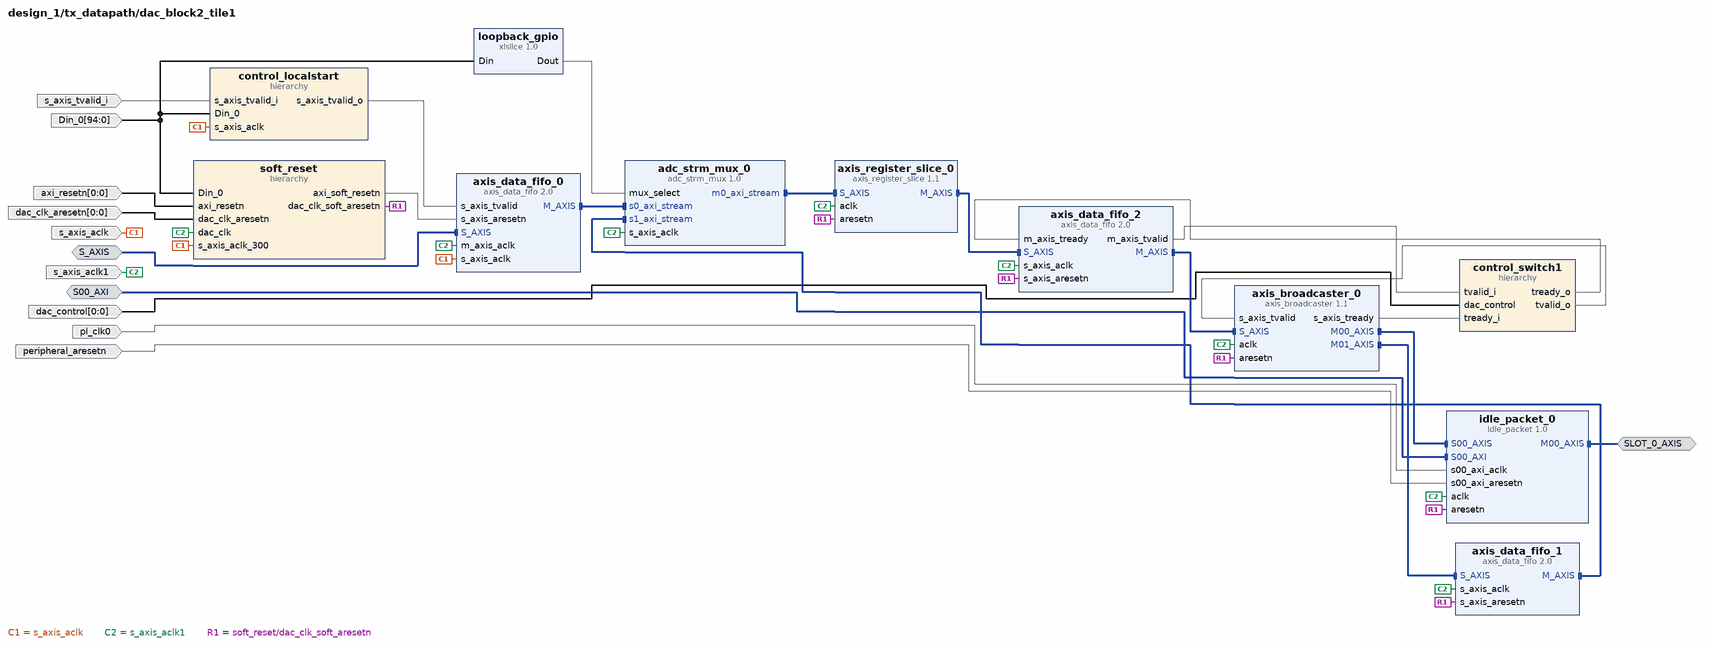
[diagram p36: block diagram inside /tx_datapath/dac_block2_tile1]
create_bd_intf_pin -mode Slave -vlnv xilinx.com:interface:axis_rtl:1.0 S_AXIS
create_bd_intf_pin -mode Master -vlnv xilinx.com:interface:axis_rtl:1.0 SLOT_0_AXIS
create_bd_intf_pin -mode Slave -vlnv xilinx.com:interface:aximm_rtl:1.0 S00_AXI
create_bd_pin -dir I -type clk s_axis_aclk
create_bd_pin -dir I -type clk s_axis_aclk1
create_bd_pin -dir I -from 0 -to 0 dac_control
create_bd_pin -dir I -from 94 -to 0 Din_0
create_bd_pin -dir I -from 0 -to 0 axi_resetn
create_bd_pin -dir I -from 0 -to 0 dac_clk_aresetn
create_bd_pin -dir I s_axis_tvalid_i
create_bd_pin -dir I -type clk pl_clk0
create_bd_pin -dir I -type rst peripheral_aresetn

create_bd_cell -type ip -vlnv xilinx.com:ip:axis_data_fifo:2.0 axis_data_fifo_0
set_property -dict [list \
  CONFIG.FIFO_DEPTH 16 \
  CONFIG.FIFO_MEMORY_TYPE block \
  CONFIG.HAS_RD_DATA_COUNT 1 \
  CONFIG.HAS_TKEEP 1 \
  CONFIG.HAS_TLAST 1 \
  CONFIG.HAS_WR_DATA_COUNT 1 \
  CONFIG.IS_ACLK_ASYNC 1 \
  CONFIG.SYNCHRONIZATION_STAGES 2 \
  CONFIG.TDATA_NUM_BYTES 32 \
] [get_bd_cells axis_data_fifo_0]
create_bd_cell -type ip -vlnv xilinx.com:ip:axis_data_fifo:2.0 axis_data_fifo_1
set_property -dict [list \
  CONFIG.FIFO_DEPTH 16 \
  CONFIG.FIFO_MEMORY_TYPE block \
  CONFIG.HAS_RD_DATA_COUNT 1 \
  CONFIG.HAS_TKEEP 1 \
  CONFIG.HAS_TLAST 1 \
  CONFIG.HAS_WR_DATA_COUNT 1 \
  CONFIG.TDATA_NUM_BYTES 32 \
] [get_bd_cells axis_data_fifo_1]
create_bd_cell -type ip -vlnv xilinx.com:ip:axis_data_fifo:2.0 axis_data_fifo_2
set_property -dict [list \
  CONFIG.FIFO_DEPTH 4096 \
  CONFIG.FIFO_MEMORY_TYPE block \
  CONFIG.HAS_RD_DATA_COUNT 1 \
  CONFIG.HAS_TKEEP 1 \
  CONFIG.HAS_TLAST 1 \
  CONFIG.HAS_WR_DATA_COUNT 1 \
  CONFIG.TDATA_NUM_BYTES 32 \
] [get_bd_cells axis_data_fifo_2]
create_bd_cell -type ip -vlnv user.org:user:adc_strm_mux:1.0 adc_strm_mux_0
create_bd_cell -type ip -vlnv xilinx.com:ip:axis_register_slice:1.1 axis_register_slice_0
set_property -dict {CONFIG.HAS_TKEEP 1 CONFIG.HAS_TLAST 1 CONFIG.TDATA_NUM_BYTES 32} [get_bd_cells axis_register_slice_0]
create_bd_cell -type hier soft_reset
create_bd_cell -type ip -vlnv xilinx.com:ip:axis_broadcaster:1.1 axis_broadcaster_0
set_property -dict [list \
  CONFIG.M00_TDATA_REMAP {tdata[255:0]} \
  CONFIG.M01_TDATA_REMAP {tdata[255:0]} \
  CONFIG.M_TDATA_NUM_BYTES 32 \
  CONFIG.S_TDATA_NUM_BYTES 32 \
] [get_bd_cells axis_broadcaster_0]
create_bd_cell -type ip -vlnv xilinx.com:ip:xlslice:1.0 loopback_gpio
set_property -dict {CONFIG.DIN_FROM 14 CONFIG.DIN_TO 14 CONFIG.DIN_WIDTH 95 CONFIG.DOUT_WIDTH 1} [get_bd_cells loopback_gpio]
create_bd_cell -type hier control_switch1
create_bd_cell -type hier control_localstart
create_bd_cell -type ip -vlnv user.org:user:idle_packet:1.0 idle_packet_0

# ---- hierarchy /tx_datapath/dac_block2_tile1/soft_reset ----
current_bd_instance /tx_datapath/dac_block2_tile1/soft_reset
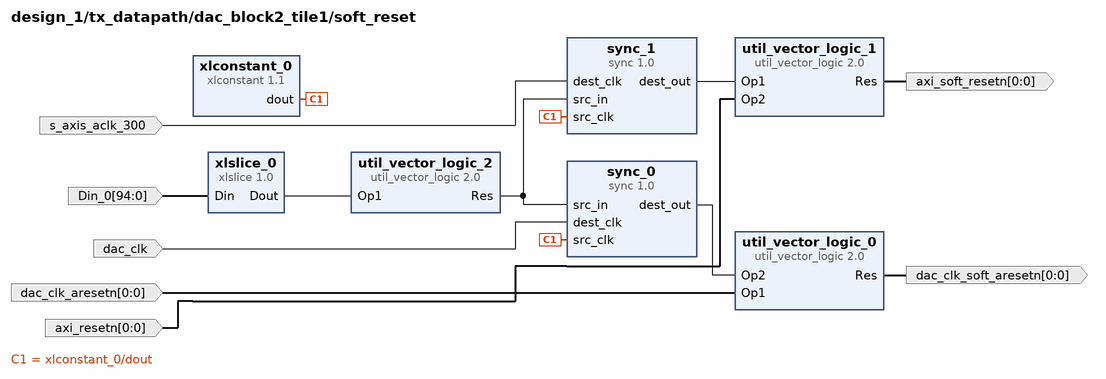
[diagram p37: block diagram inside /tx_datapath/dac_block2_tile1/soft_reset]
create_bd_pin -dir I -from 94 -to 0 Din_0
create_bd_pin -dir I -type clk dac_clk
create_bd_pin -dir I -type clk s_axis_aclk_300
create_bd_pin -dir O -from 0 -to 0 dac_clk_soft_aresetn
create_bd_pin -dir O -from 0 -to 0 axi_soft_resetn
create_bd_pin -dir I -from 0 -to 0 dac_clk_aresetn
create_bd_pin -dir I -from 0 -to 0 axi_resetn

create_bd_cell -type ip -vlnv xilinx.com:ip:xlslice:1.0 xlslice_0
set_property -dict {CONFIG.DIN_FROM 6 CONFIG.DIN_TO 6 CONFIG.DIN_WIDTH 95 CONFIG.DOUT_WIDTH 1} [get_bd_cells xlslice_0]
create_bd_cell -type ip -vlnv xilinx.com:user:sync:1.0 sync_0
set_property -dict {CONFIG.SRC_INPUT_REG 0} [get_bd_cells sync_0]
create_bd_cell -type ip -vlnv xilinx.com:user:sync:1.0 sync_1
set_property -dict {CONFIG.SRC_INPUT_REG 0} [get_bd_cells sync_1]
create_bd_cell -type ip -vlnv xilinx.com:ip:xlconstant:1.1 xlconstant_0
set_property -dict {CONFIG.CONST_VAL 0} [get_bd_cells xlconstant_0]
create_bd_cell -type ip -vlnv xilinx.com:ip:util_vector_logic:2.0 util_vector_logic_2
set_property -dict {CONFIG.C_OPERATION not CONFIG.C_SIZE 1} [get_bd_cells util_vector_logic_2]
create_bd_cell -type ip -vlnv xilinx.com:ip:util_vector_logic:2.0 util_vector_logic_0
set_property -dict {CONFIG.C_SIZE 1} [get_bd_cells util_vector_logic_0]
create_bd_cell -type ip -vlnv xilinx.com:ip:util_vector_logic:2.0 util_vector_logic_1
set_property -dict {CONFIG.C_SIZE 1} [get_bd_cells util_vector_logic_1]

# ---- hierarchy /tx_datapath/dac_block2_tile1/control_switch1 ----
current_bd_instance /tx_datapath/dac_block2_tile1/control_switch1
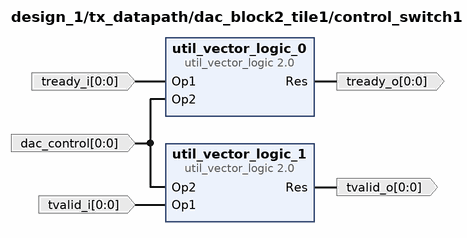
[diagram p38: block diagram inside /tx_datapath/dac_block2_tile1/control_switch1]
create_bd_pin -dir I -from 0 -to 0 tready_i
create_bd_pin -dir I -from 0 -to 0 tvalid_i
create_bd_pin -dir O -from 0 -to 0 tready_o
create_bd_pin -dir O -from 0 -to 0 tvalid_o
create_bd_pin -dir I -from 0 -to 0 dac_control

create_bd_cell -type ip -vlnv xilinx.com:ip:util_vector_logic:2.0 util_vector_logic_0
set_property -dict {CONFIG.C_SIZE 1} [get_bd_cells util_vector_logic_0]
create_bd_cell -type ip -vlnv xilinx.com:ip:util_vector_logic:2.0 util_vector_logic_1
set_property -dict {CONFIG.C_SIZE 1} [get_bd_cells util_vector_logic_1]

# ---- hierarchy /tx_datapath/dac_block2_tile1/control_localstart ----
current_bd_instance /tx_datapath/dac_block2_tile1/control_localstart
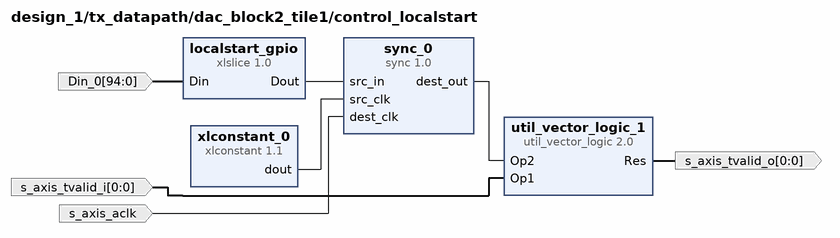
[diagram p39: block diagram inside /tx_datapath/dac_block2_tile1/control_localstart]
create_bd_pin -dir I -from 0 -to 0 s_axis_tvalid_i
create_bd_pin -dir O -from 0 -to 0 s_axis_tvalid_o
create_bd_pin -dir I -from 94 -to 0 Din_0
create_bd_pin -dir I -type clk s_axis_aclk

create_bd_cell -type ip -vlnv xilinx.com:ip:util_vector_logic:2.0 util_vector_logic_1
set_property -dict {CONFIG.C_SIZE 1} [get_bd_cells util_vector_logic_1]
create_bd_cell -type ip -vlnv xilinx.com:ip:xlslice:1.0 localstart_gpio
set_property -dict {CONFIG.DIN_FROM 22 CONFIG.DIN_TO 22 CONFIG.DIN_WIDTH 95 CONFIG.DOUT_WIDTH 1} [get_bd_cells localstart_gpio]
create_bd_cell -type ip -vlnv xilinx.com:user:sync:1.0 sync_0
set_property -dict {CONFIG.DEST_SYNC_FF 2 CONFIG.SRC_INPUT_REG 0} [get_bd_cells sync_0]
create_bd_cell -type ip -vlnv xilinx.com:ip:xlconstant:1.1 xlconstant_0
set_property -dict {CONFIG.CONST_VAL 0} [get_bd_cells xlconstant_0]

# ---- hierarchy /tx_datapath/dac_block0_tile1 ----
current_bd_instance /tx_datapath/dac_block0_tile1
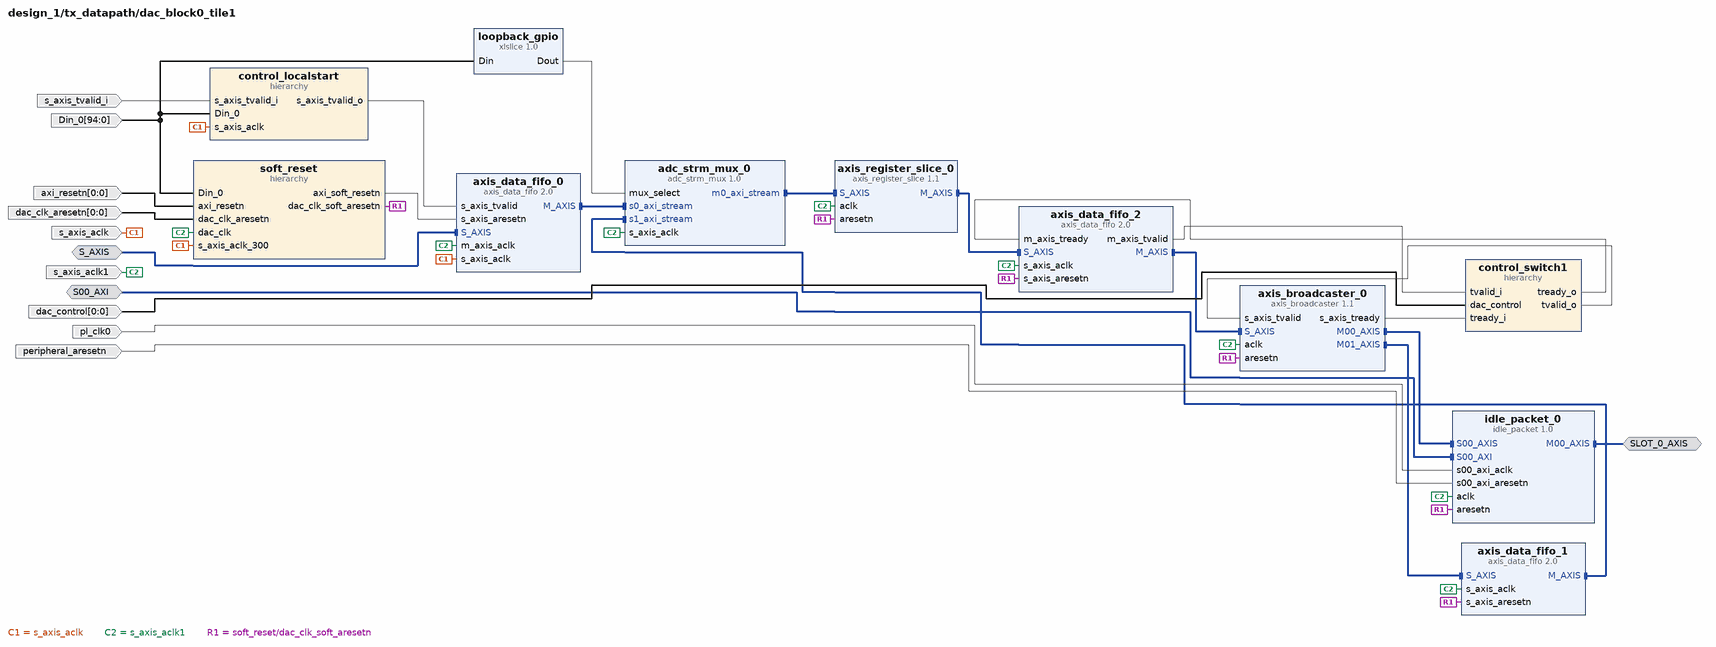
[diagram p40: block diagram inside /tx_datapath/dac_block0_tile1]
create_bd_intf_pin -mode Slave -vlnv xilinx.com:interface:axis_rtl:1.0 S_AXIS
create_bd_intf_pin -mode Master -vlnv xilinx.com:interface:axis_rtl:1.0 SLOT_0_AXIS
create_bd_intf_pin -mode Slave -vlnv xilinx.com:interface:aximm_rtl:1.0 S00_AXI
create_bd_pin -dir I -type clk s_axis_aclk
create_bd_pin -dir I -type clk s_axis_aclk1
create_bd_pin -dir I -from 0 -to 0 dac_control
create_bd_pin -dir I -from 94 -to 0 Din_0
create_bd_pin -dir I -from 0 -to 0 axi_resetn
create_bd_pin -dir I -from 0 -to 0 dac_clk_aresetn
create_bd_pin -dir I s_axis_tvalid_i
create_bd_pin -dir I -type clk pl_clk0
create_bd_pin -dir I -type rst peripheral_aresetn

create_bd_cell -type ip -vlnv xilinx.com:ip:axis_data_fifo:2.0 axis_data_fifo_0
set_property -dict [list \
  CONFIG.FIFO_DEPTH 16 \
  CONFIG.FIFO_MEMORY_TYPE block \
  CONFIG.HAS_RD_DATA_COUNT 1 \
  CONFIG.HAS_TKEEP 1 \
  CONFIG.HAS_TLAST 1 \
  CONFIG.HAS_WR_DATA_COUNT 1 \
  CONFIG.IS_ACLK_ASYNC 1 \
  CONFIG.SYNCHRONIZATION_STAGES 2 \
  CONFIG.TDATA_NUM_BYTES 32 \
] [get_bd_cells axis_data_fifo_0]
create_bd_cell -type ip -vlnv xilinx.com:ip:axis_data_fifo:2.0 axis_data_fifo_1
set_property -dict [list \
  CONFIG.FIFO_DEPTH 16 \
  CONFIG.FIFO_MEMORY_TYPE block \
  CONFIG.HAS_RD_DATA_COUNT 1 \
  CONFIG.HAS_TKEEP 1 \
  CONFIG.HAS_TLAST 1 \
  CONFIG.HAS_WR_DATA_COUNT 1 \
  CONFIG.TDATA_NUM_BYTES 32 \
] [get_bd_cells axis_data_fifo_1]
create_bd_cell -type ip -vlnv xilinx.com:ip:axis_data_fifo:2.0 axis_data_fifo_2
set_property -dict [list \
  CONFIG.FIFO_DEPTH 4096 \
  CONFIG.FIFO_MEMORY_TYPE block \
  CONFIG.HAS_RD_DATA_COUNT 1 \
  CONFIG.HAS_TKEEP 1 \
  CONFIG.HAS_TLAST 1 \
  CONFIG.HAS_WR_DATA_COUNT 1 \
  CONFIG.TDATA_NUM_BYTES 32 \
] [get_bd_cells axis_data_fifo_2]
create_bd_cell -type ip -vlnv user.org:user:adc_strm_mux:1.0 adc_strm_mux_0
create_bd_cell -type ip -vlnv xilinx.com:ip:axis_register_slice:1.1 axis_register_slice_0
set_property -dict {CONFIG.HAS_TKEEP 1 CONFIG.HAS_TLAST 1 CONFIG.TDATA_NUM_BYTES 32} [get_bd_cells axis_register_slice_0]
create_bd_cell -type hier soft_reset
create_bd_cell -type ip -vlnv xilinx.com:ip:axis_broadcaster:1.1 axis_broadcaster_0
set_property -dict [list \
  CONFIG.M00_TDATA_REMAP {tdata[255:0]} \
  CONFIG.M01_TDATA_REMAP {tdata[255:0]} \
  CONFIG.M_TDATA_NUM_BYTES 32 \
  CONFIG.S_TDATA_NUM_BYTES 32 \
] [get_bd_cells axis_broadcaster_0]
create_bd_cell -type ip -vlnv xilinx.com:ip:xlslice:1.0 loopback_gpio
set_property -dict {CONFIG.DIN_FROM 12 CONFIG.DIN_TO 12 CONFIG.DIN_WIDTH 95 CONFIG.DOUT_WIDTH 1} [get_bd_cells loopback_gpio]
create_bd_cell -type hier control_switch1
create_bd_cell -type hier control_localstart
create_bd_cell -type ip -vlnv user.org:user:idle_packet:1.0 idle_packet_0

# ---- hierarchy /tx_datapath/dac_block0_tile1/soft_reset ----
current_bd_instance /tx_datapath/dac_block0_tile1/soft_reset
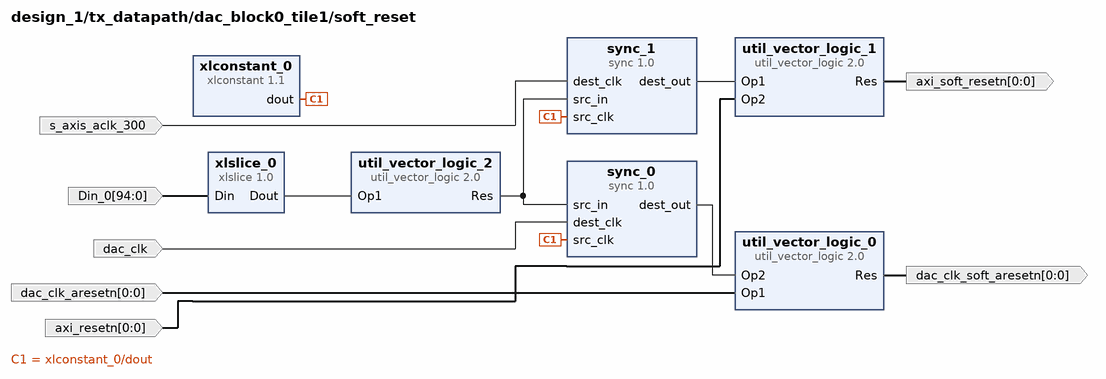
[diagram p41: block diagram inside /tx_datapath/dac_block0_tile1/soft_reset]
create_bd_pin -dir I -from 94 -to 0 Din_0
create_bd_pin -dir I -type clk dac_clk
create_bd_pin -dir I -type clk s_axis_aclk_300
create_bd_pin -dir O -from 0 -to 0 dac_clk_soft_aresetn
create_bd_pin -dir O -from 0 -to 0 axi_soft_resetn
create_bd_pin -dir I -from 0 -to 0 dac_clk_aresetn
create_bd_pin -dir I -from 0 -to 0 axi_resetn

create_bd_cell -type ip -vlnv xilinx.com:ip:xlslice:1.0 xlslice_0
set_property -dict {CONFIG.DIN_FROM 4 CONFIG.DIN_TO 4 CONFIG.DIN_WIDTH 95 CONFIG.DOUT_WIDTH 1} [get_bd_cells xlslice_0]
create_bd_cell -type ip -vlnv xilinx.com:user:sync:1.0 sync_0
set_property -dict {CONFIG.SRC_INPUT_REG 0} [get_bd_cells sync_0]
create_bd_cell -type ip -vlnv xilinx.com:user:sync:1.0 sync_1
set_property -dict {CONFIG.SRC_INPUT_REG 0} [get_bd_cells sync_1]
create_bd_cell -type ip -vlnv xilinx.com:ip:xlconstant:1.1 xlconstant_0
set_property -dict {CONFIG.CONST_VAL 0} [get_bd_cells xlconstant_0]
create_bd_cell -type ip -vlnv xilinx.com:ip:util_vector_logic:2.0 util_vector_logic_2
set_property -dict {CONFIG.C_OPERATION not CONFIG.C_SIZE 1} [get_bd_cells util_vector_logic_2]
create_bd_cell -type ip -vlnv xilinx.com:ip:util_vector_logic:2.0 util_vector_logic_0
set_property -dict {CONFIG.C_SIZE 1} [get_bd_cells util_vector_logic_0]
create_bd_cell -type ip -vlnv xilinx.com:ip:util_vector_logic:2.0 util_vector_logic_1
set_property -dict {CONFIG.C_SIZE 1} [get_bd_cells util_vector_logic_1]

# ---- hierarchy /tx_datapath/dac_block0_tile1/control_switch1 ----
current_bd_instance /tx_datapath/dac_block0_tile1/control_switch1
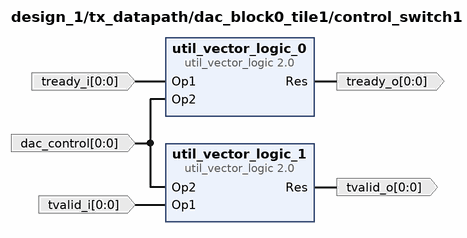
[diagram p42: block diagram inside /tx_datapath/dac_block0_tile1/control_switch1]
create_bd_pin -dir I -from 0 -to 0 tready_i
create_bd_pin -dir I -from 0 -to 0 tvalid_i
create_bd_pin -dir O -from 0 -to 0 tready_o
create_bd_pin -dir O -from 0 -to 0 tvalid_o
create_bd_pin -dir I -from 0 -to 0 dac_control

create_bd_cell -type ip -vlnv xilinx.com:ip:util_vector_logic:2.0 util_vector_logic_0
set_property -dict {CONFIG.C_SIZE 1} [get_bd_cells util_vector_logic_0]
create_bd_cell -type ip -vlnv xilinx.com:ip:util_vector_logic:2.0 util_vector_logic_1
set_property -dict {CONFIG.C_SIZE 1} [get_bd_cells util_vector_logic_1]

# ---- hierarchy /tx_datapath/dac_block0_tile1/control_localstart ----
current_bd_instance /tx_datapath/dac_block0_tile1/control_localstart
